# EAGLE design 8x8v2 (EAGLE 7.5.0)
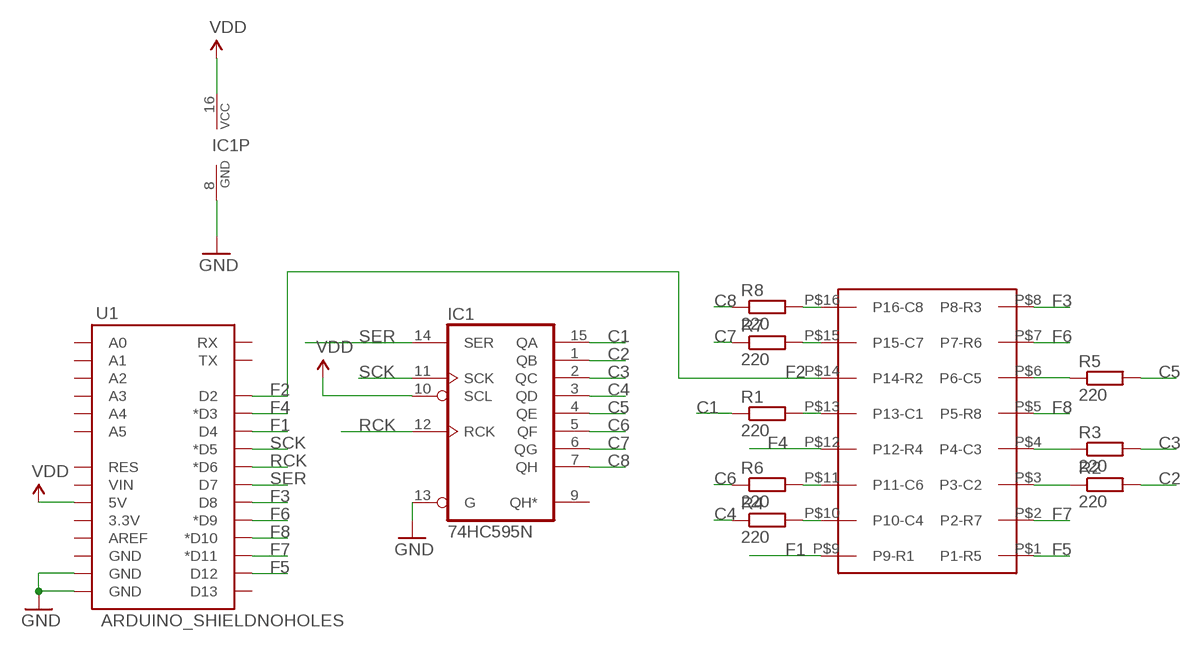
[diagram p0: schematic, sheet 1]

## Parts
IC1  74HC595N  [DIL16]
R1  220  R-EU_0207/10  [0207/10]
R2  220  R-EU_0207/10  [0207/10]
R3  220  R-EU_0207/10  [0207/10]
R4  220  R-EU_0207/10  [0207/10]
R5  220  R-EU_0207/10  [0207/10]
R6  220  R-EU_0207/10  [0207/10]
R7  220  R-EU_0207/10  [0207/10]
R8  220  R-EU_0207/10  [0207/10]
U1  ARDUINO_SHIELDNOHOLES  [DUEMILANOVE_SHIELD_NOHOLES]
U$1  MATRIX8X8  [MATRIX]

## Nets
C1: IC1.15(QA) R1.1
C2: IC1.1(QB) R2.2
C3: IC1.2(QC) R3.2
C4: IC1.3(QD) R4.1
C5: IC1.4(QE) R5.2
C6: IC1.5(QF) R6.1
C7: IC1.6(QG) R7.1
C8: IC1.7(QH) R8.1
F1: U1.D4 U$1.P$9(P9-R1)
F2: U1.D2 U$1.P$14(P14-R2)
F3: U1.D8 U$1.P$8(P8-R3)
F4: U1.D3(*D3) U$1.P$12(P12-R4)
F5: U1.D12 U$1.P$1(P1-R5)
F6: U1.D9(*D9) U$1.P$7(P7-R6)
F7: U1.D11(*D11) U$1.P$2(P2-R7)
F8: U1.D10(*D10) U$1.P$5(P5-R8)
GND: IC1.8(GND) IC1.13(G) U1.GND@0(GND) U1.GND@1(GND)
N$5: R2.1 U$1.P$3(P3-C2)
N$6: R3.1 U$1.P$4(P4-C3)
N$8: R5.1 U$1.P$6(P6-C5)
N$10: R6.2 U$1.P$11(P11-C6)
N$11: R4.2 U$1.P$10(P10-C4)
N$14: R7.2 U$1.P$15(P15-C7)
N$15: R8.2 U$1.P$16(P16-C8)
N$19: R1.2 U$1.P$13(P13-C1)
RCK: IC1.12(RCK) U1.D6(*D6)
SCK: IC1.11(SCK) U1.D5(*D5)
SER: IC1.14(SER) U1.D7
VDD: IC1.10(SCL) IC1.16(VCC) U1.5V
Unconnected: IC1.9(QH*) U1.3.3V U1.A0 U1.A1 U1.A2 U1.A3 U1.A4 U1.A5 U1.AREF U1.D13 U1.GND@2(GND) U1.RES U1.RX U1.TX U1.VIN

## Library data of the parts
IC1 = 74xx-eu:74*595: 8-bit SHIFT REGISTER, output latch
R1-R8 = resistor:R-EU_: RESISTOR, European symbol
U1 = SparkFun-Boards:ARDUINO_SHIELD: Arduino shield footprint
U$1 = matrix8x8:MATRIX8X8: Erstellt von Sören Timm

## Board
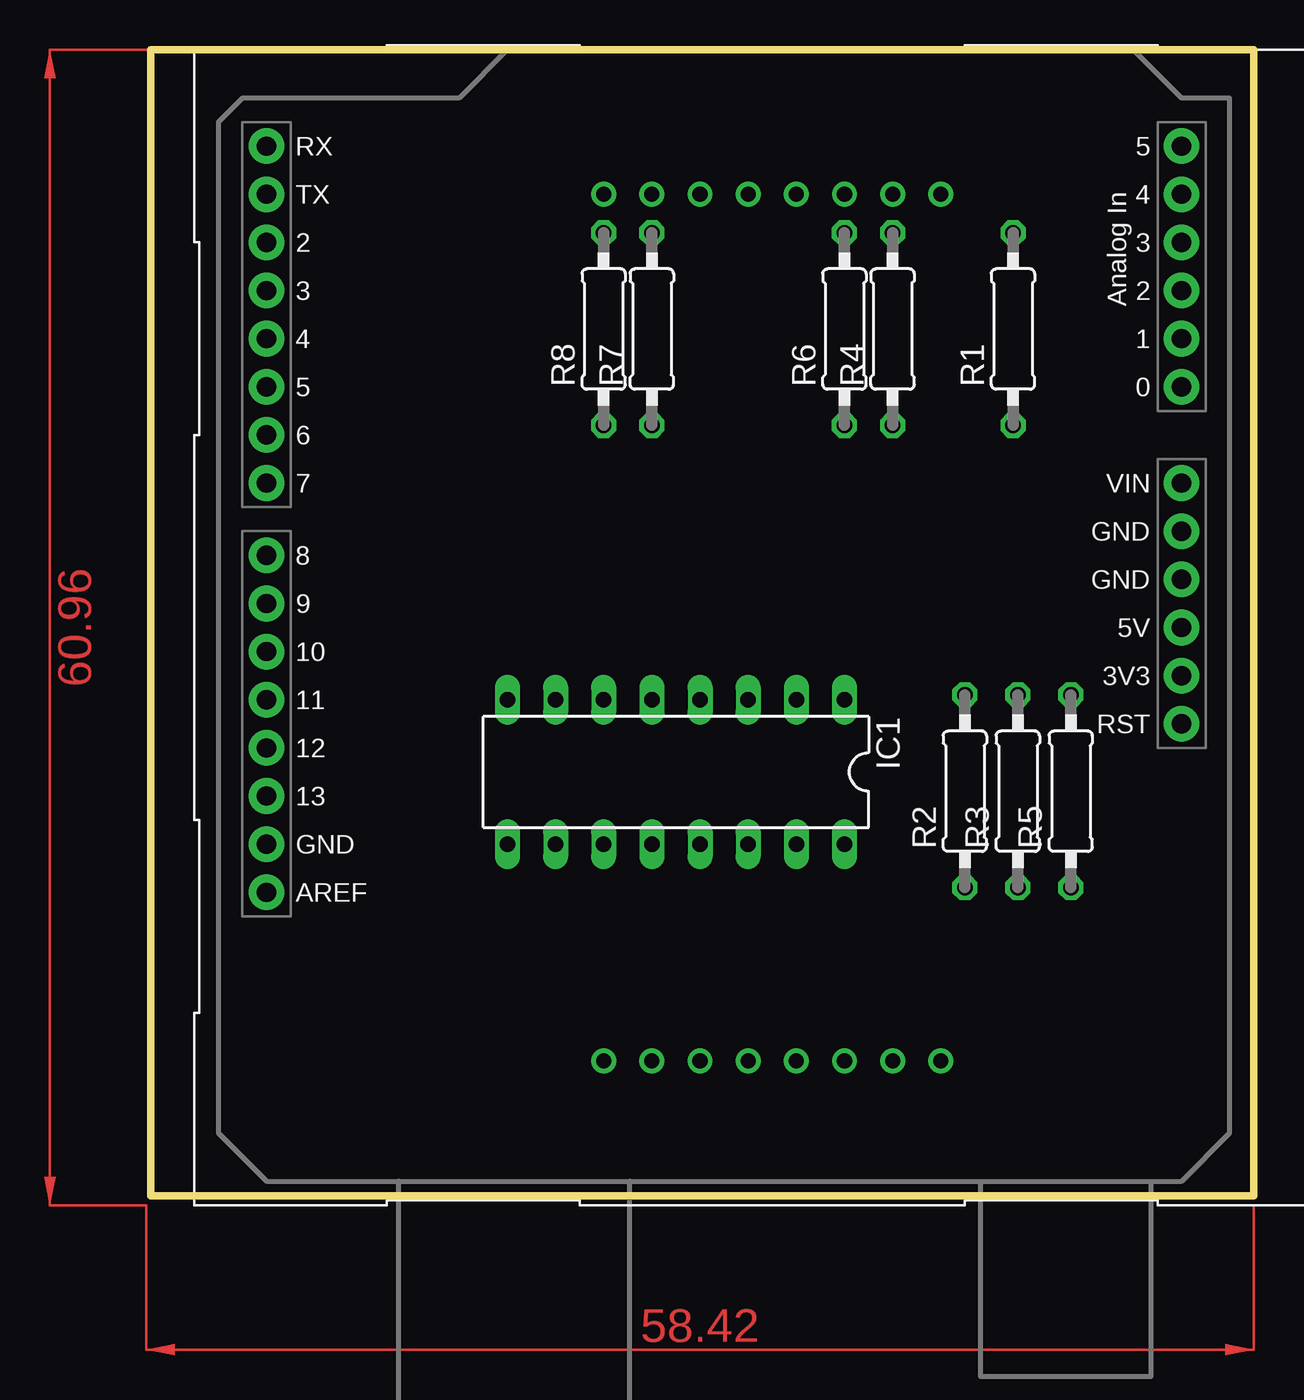
[diagram p1: board, top side]
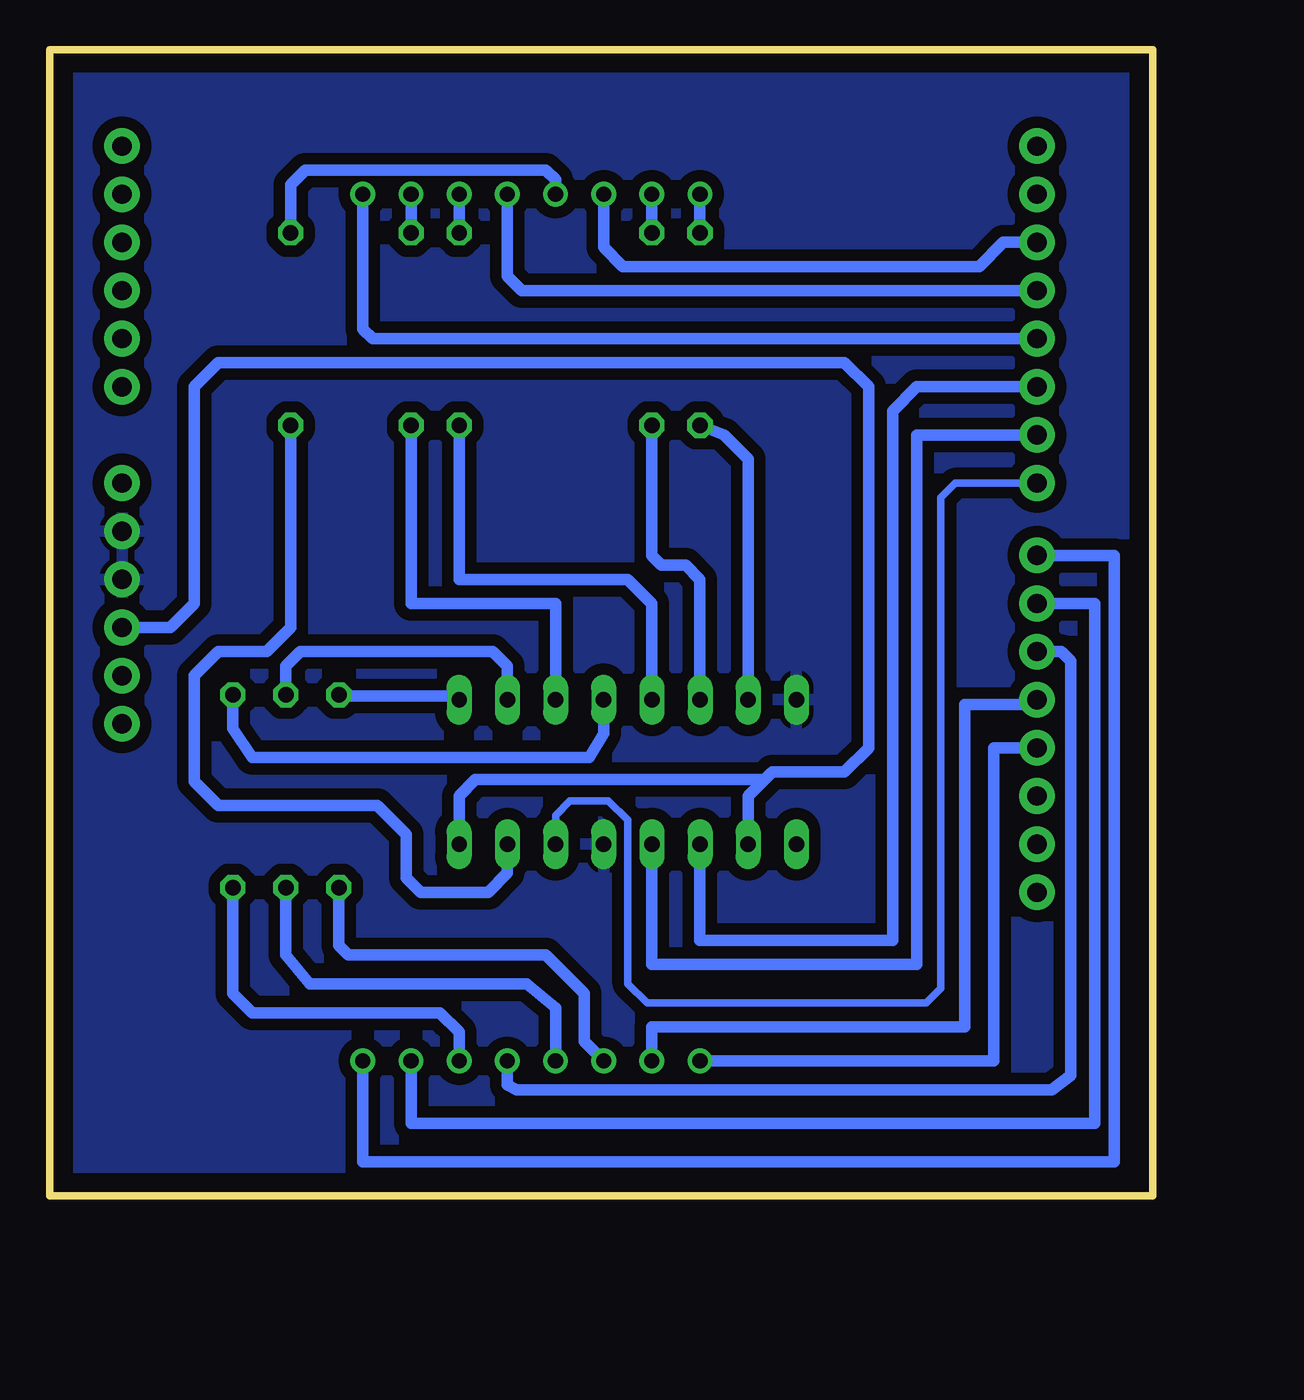
[diagram p2: board, bottom side, seen from below]

Size 58.17 x 60.45 mm. Coordinates in mm from the lower left corner, seen from the top.
Outline: 0,60.45 58.17,60.45 58.17,0 0,0 0,60.45
Copper layers (1*16): Top 0.035mm / dielectric 1.5mm / Bottom 0.035mm
Design rules "default *": minimum track width 16mil, minimum drill 24mil, track to track 8mil, track to pad 8mil, pad to pad 8mil, via to via 8mil, smd to smd 8mil, copper to edge 40mil, drill to drill 8mil, minimum pad ring 10mil, minimum via ring 8mil, stop-mask expansion 4mil, vias tented up to drill 0mil, thermal gap 10mil

### Footprints (pad centres in the part's own frame; a part is rotated, then mirrored left to right if it is on the bottom)
DIL16 = drill 0.813 long: 1 -8.89,-3.81; 2 -6.35,-3.81; 3 -3.81,-3.81; 4 -1.27,-3.81; 5 1.27,-3.81; 6 3.81,-3.81; 7 6.35,-3.81; 8 8.89,-3.81; 9 8.89,3.81; 10 6.35,3.81; 11 3.81,3.81; 12 1.27,3.81; 13 -1.27,3.81; 14 -3.81,3.81; 15 -6.35,3.81; 16 -8.89,3.81
0207/10 = drill 0.813 octagon: 1 -5.08,0; 2 5.08,0
DUEMILANOVE_SHIELD_NOHOLES = drill 1.016 pad 1.88: 3.3V 50.8,26.67; 5V 50.8,29.21; A0 50.8,41.91; A1 50.8,44.45; A2 50.8,46.99; A3 50.8,49.53; A4 50.8,52.07; A5 50.8,54.61; AREF 2.54,15.24; D2 2.54,49.53; D3 2.54,46.99; D4 2.54,44.45; D5 2.54,41.91; D6 2.54,39.37; D7 2.54,36.83; D8 2.54,33.02; D9 2.54,30.48; D10 2.54,27.94; D11 2.54,25.4; D12 2.54,22.86; D13 2.54,20.32; GND@0 50.8,31.75; GND@1 50.8,34.29; GND@2 2.54,17.78; RES 50.8,24.13; RX 2.54,54.61; TX 2.54,52.07; VIN 50.8,36.83
MATRIX = drill 0.8: P$1 21.59,-53.34; P$2 24.13,-53.34; P$3 26.67,-53.34; P$4 29.21,-53.34; P$5 31.75,-53.34; P$6 34.29,-53.34; P$7 36.83,-53.34; P$8 39.37,-53.34; P$9 39.37,-7.62; P$10 36.83,-7.62; P$11 34.29,-7.62; P$12 31.75,-7.62; P$13 29.21,-7.62; P$14 26.67,-7.62; P$15 24.13,-7.62; P$16 21.59,-7.62

### Placement (x,y rotation side)
IC1  27.69,22.35 180 top
R1  45.47,45.72 90 top
R2  42.93,21.34 90 top
R3  45.72,21.34 90 top
R4  39.12,45.72 90 top
R5  48.51,21.34 90 top
R6  36.58,45.72 90 top
R7  26.42,45.72 90 top
R8  23.88,45.72 90 top
U1  3.56,0.76 0 top
U$1  2.29,60.45 0 top

### Tracks (layer width: path | path; a pad name or v marks a point on that pad's centre or on a via)
C1
  Bottom 0.406: 34.04,17.53 IC1.15
  Bottom 0.61: R1.1 45.47,29.97 46.74,28.7 49.28,28.7 50.55,27.43 50.55,21.84 49.28,20.57 40.89,20.57 39.37,19.05 39.37,16.76 38.61,16 35.05,16 34.04,17.02 IC1.15
C2
  Bottom 0.61: IC1.1 36.83,26.37 42.93,26.37 R2.2
C3
  Bottom 0.61: IC1.2 34.04,27.94 34.8,28.7 44.96,28.7 45.72,27.94 R3.2
C4
  Bottom 0.61: IC1.3 31.5,31.24 39.12,31.24 R4.1
C5
  Bottom 0.61: R5.2 48.51,24.64 47.5,23.11 29.72,23.11 28.96,24.38 IC1.4
C6
  Bottom 0.61: IC1.5 26.42,31.24 27.69,32.51 36.58,32.51 R6.1
C7
  Bottom 0.61: R7.1 26.42,33.78 25.91,33.27 24.64,33.27 23.88,32.51 IC1.6
C8
  Bottom 0.61: R8.1 22.61,40.13 21.34,38.86 IC1.7
F1
  Bottom 0.61: U1.D4 41.15,45.21 41.66,45.72 U$1.P$9
F2
  Bottom 0.61: U$1.P$14 28.96,50.04 27.94,49.02 9.14,49.02 7.87,50.29 U1.D2
F3
  Bottom 0.406: 41.4,6.86 U$1.P$8
  Bottom 0.61: U1.D8 2.03,33.78 2.03,1.78 41.66,1.78 U$1.P$8
F4
  Bottom 0.61: U1.D3 33.27,47.75 34.04,48.51 U$1.P$12
F5
  Bottom 0.61: U1.D12 8.38,23.62 8.38,7.11 U$1.P$1
F6
  Bottom 0.406: 38.96,6.86 U$1.P$7
  Bottom 0.61: U$1.P$7 39.12,3.81 3.05,3.81 3.05,31.24 U1.D9
F7
  Bottom 0.61: U$1.P$2 26.42,8.89 9.91,8.89 9.91,25.91 6.35,25.91 U1.D11
F8
  Bottom 0.61: U1.D10 4.83,28.7 4.32,28.19 4.32,6.35 5.33,5.59 33.53,5.59 34.04,5.84 U$1.P$5
GND
  pour Bottom (isolate 0.61): -0.25,60.45 59.18,60.71 59.44,-0.51 -0.25,-0.51
N$5
  Bottom 0.61: R2.1 42.93,13.21 42.42,12.7 32,12.7 29.97,10.67 29.97,8.13 U$1.P$3
N$6
  Bottom 0.61: R3.1 45.72,12.7 44.45,11.18 33.02,11.18 31.5,9.91 U$1.P$4
N$8
  Bottom 0.61: R5.1 48.51,10.67 47.5,9.65 37.59,9.65 36.58,8.64 U$1.P$6
N$10
  Bottom 0.61: U$1.P$11 R6.2
N$11
  Bottom 0.61: U$1.P$10 R4.2
N$14
  Bottom 0.61: U$1.P$15 R7.2
N$15
  Bottom 0.61: U$1.P$16 R8.2
N$19
  Bottom 0.61: U$1.P$13 31.5,53.59 32,54.1 44.7,54.1 45.47,53.34 R1.2
RCK
  Bottom 0.61: U1.D6 12.45,40.13 12.45,12.19 26.42,12.19 IC1.12
SCK
  Bottom 0.61: U1.D5 12.45,42.67 13.72,41.4 13.72,13.46 23.88,13.46 IC1.11
SER
  Bottom 0.406: U1.D7 10.41,37.59 11.18,36.83 11.18,10.92 11.94,10.16 26.67,10.16 27.69,11.18 27.69,19.81 28.7,20.83 30.73,20.83 31.5,20.07 IC1.14
VDD
  Bottom 0.406: 20.5,21.95 20.07,22.35
  Bottom 0.61: U1.5V 51.82,29.97 50.55,31.24 50.55,42.67 49.28,43.94 16.26,43.94 14.99,42.67 14.99,23.62 16.26,22.35 20.07,22.35 21.34,21.08 IC1.10 | IC1.16 36.58,21.08 35.74,21.95 20.5,21.95
(copper drawn outside any net)
  shapes: Top area x2